# Altium schematic sheet CON_RS485_RJ45.SchDoc: RS485 Connector
size A4; DocumentNumber: 41; SheetNumber: 42; SheetTotal: 77
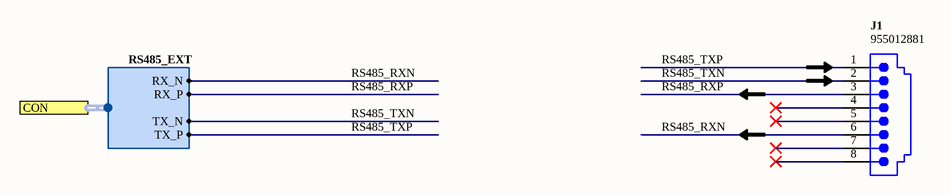
[diagram p0: CON_RS485_RJ45.SchDoc]

## Parts
J1  955012881  [955012881]

## Ports
CON (harness RS485_EXT)

## Harnesses
RS485_EXT: TX_N, RX_N, RX_P, TX_P

## Nets
RS485_RXN: J1.6 ; port CON.RX_N
RS485_RXP: J1.3 ; port CON.RX_P
RS485_TXN: J1.2 ; port CON.TX_N
RS485_TXP: J1.1 ; port CON.TX_P

Not connected (* = marked no-connect by the designer): J1 4* 5* 7* 8*

## Notes on the sheet
- Sheet Title
- Project Title
- Size:
- Date:
- A4
- Assy:
- Time:
- Revision:
- Sheet
- of
- File:

## Library data of the parts
J1 = D-300-0117: Socket, PC Jack 8-Way, R/A Low-profile; Connector type: Right Angle; Max Current: mA; Mounting Technology: Surface Mount; Status: Unreleased; Category: Connector